# Altium schematic sheet Sheet1.SchDoc
size A4
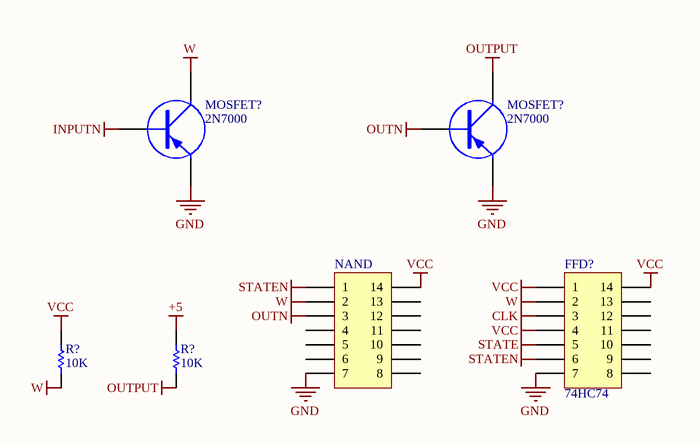
[diagram p0: Sheet1.SchDoc]

## Parts
(Parts that share a designator on the sheet are numbered #1, #2 ... from top to bottom, then left to right.)
FFD?  74HC74  [DIP14]
MOSFET?#1  2N7000  [TO92]
MOSFET?#2  2N7000  [TO92]
NAND  (no value)  [DIP14]
R?#1  10K  [RES400]
R?#2  10K  [RES400]

## Nets
+5: R?#2.2
CLK: FFD?.3
GND: FFD?.7 MOSFET?#1.3(E) MOSFET?#2.3(E) NAND.7
INPUTN: MOSFET?#1.1(B)
OUTN: MOSFET?#2.1(B) NAND.3
OUTPUT: MOSFET?#2.2(C) R?#2.1
STATE: FFD?.5
STATEN: FFD?.6 NAND.1
VCC: FFD?.1 FFD?.4 FFD?.14 NAND.14 R?#1.2
W: FFD?.2 MOSFET?#1.2(C) NAND.2 R?#1.1

Not connected (* = marked no-connect by the designer): FFD? 8 9 10 11 12 13; NAND 4 5 6 8 9 10 11 12 13

## Library data of the parts
FFD? NAND = IC_DIP14
MOSFET?#1 MOSFET?#2 = TRANSISTOR PNP
R?#1 R?#2 = RES